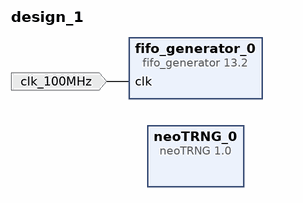
[diagram p0: block diagram of the top level]
# Vivado block design design_1, xc7z020clg484-1, Vivado 2020.2
create_bd_design design_1

create_bd_port -dir I -type clk clk_100MHz
set_property -dict {CONFIG.FREQ_HZ 100000000} [get_bd_ports clk_100MHz]

create_bd_cell -type ip -vlnv user.org:user:neoTRNG:1.0 neoTRNG_0
create_bd_cell -type ip -vlnv xilinx.com:ip:fifo_generator:13.2 fifo_generator_0

# ---- connections ----

connect_bd_net [get_bd_ports clk_100MHz] [get_bd_pins fifo_generator_0/clk]

validate_bd_design
save_bd_design
